# Altium schematic sheet Sheet1.SchDoc
size A3
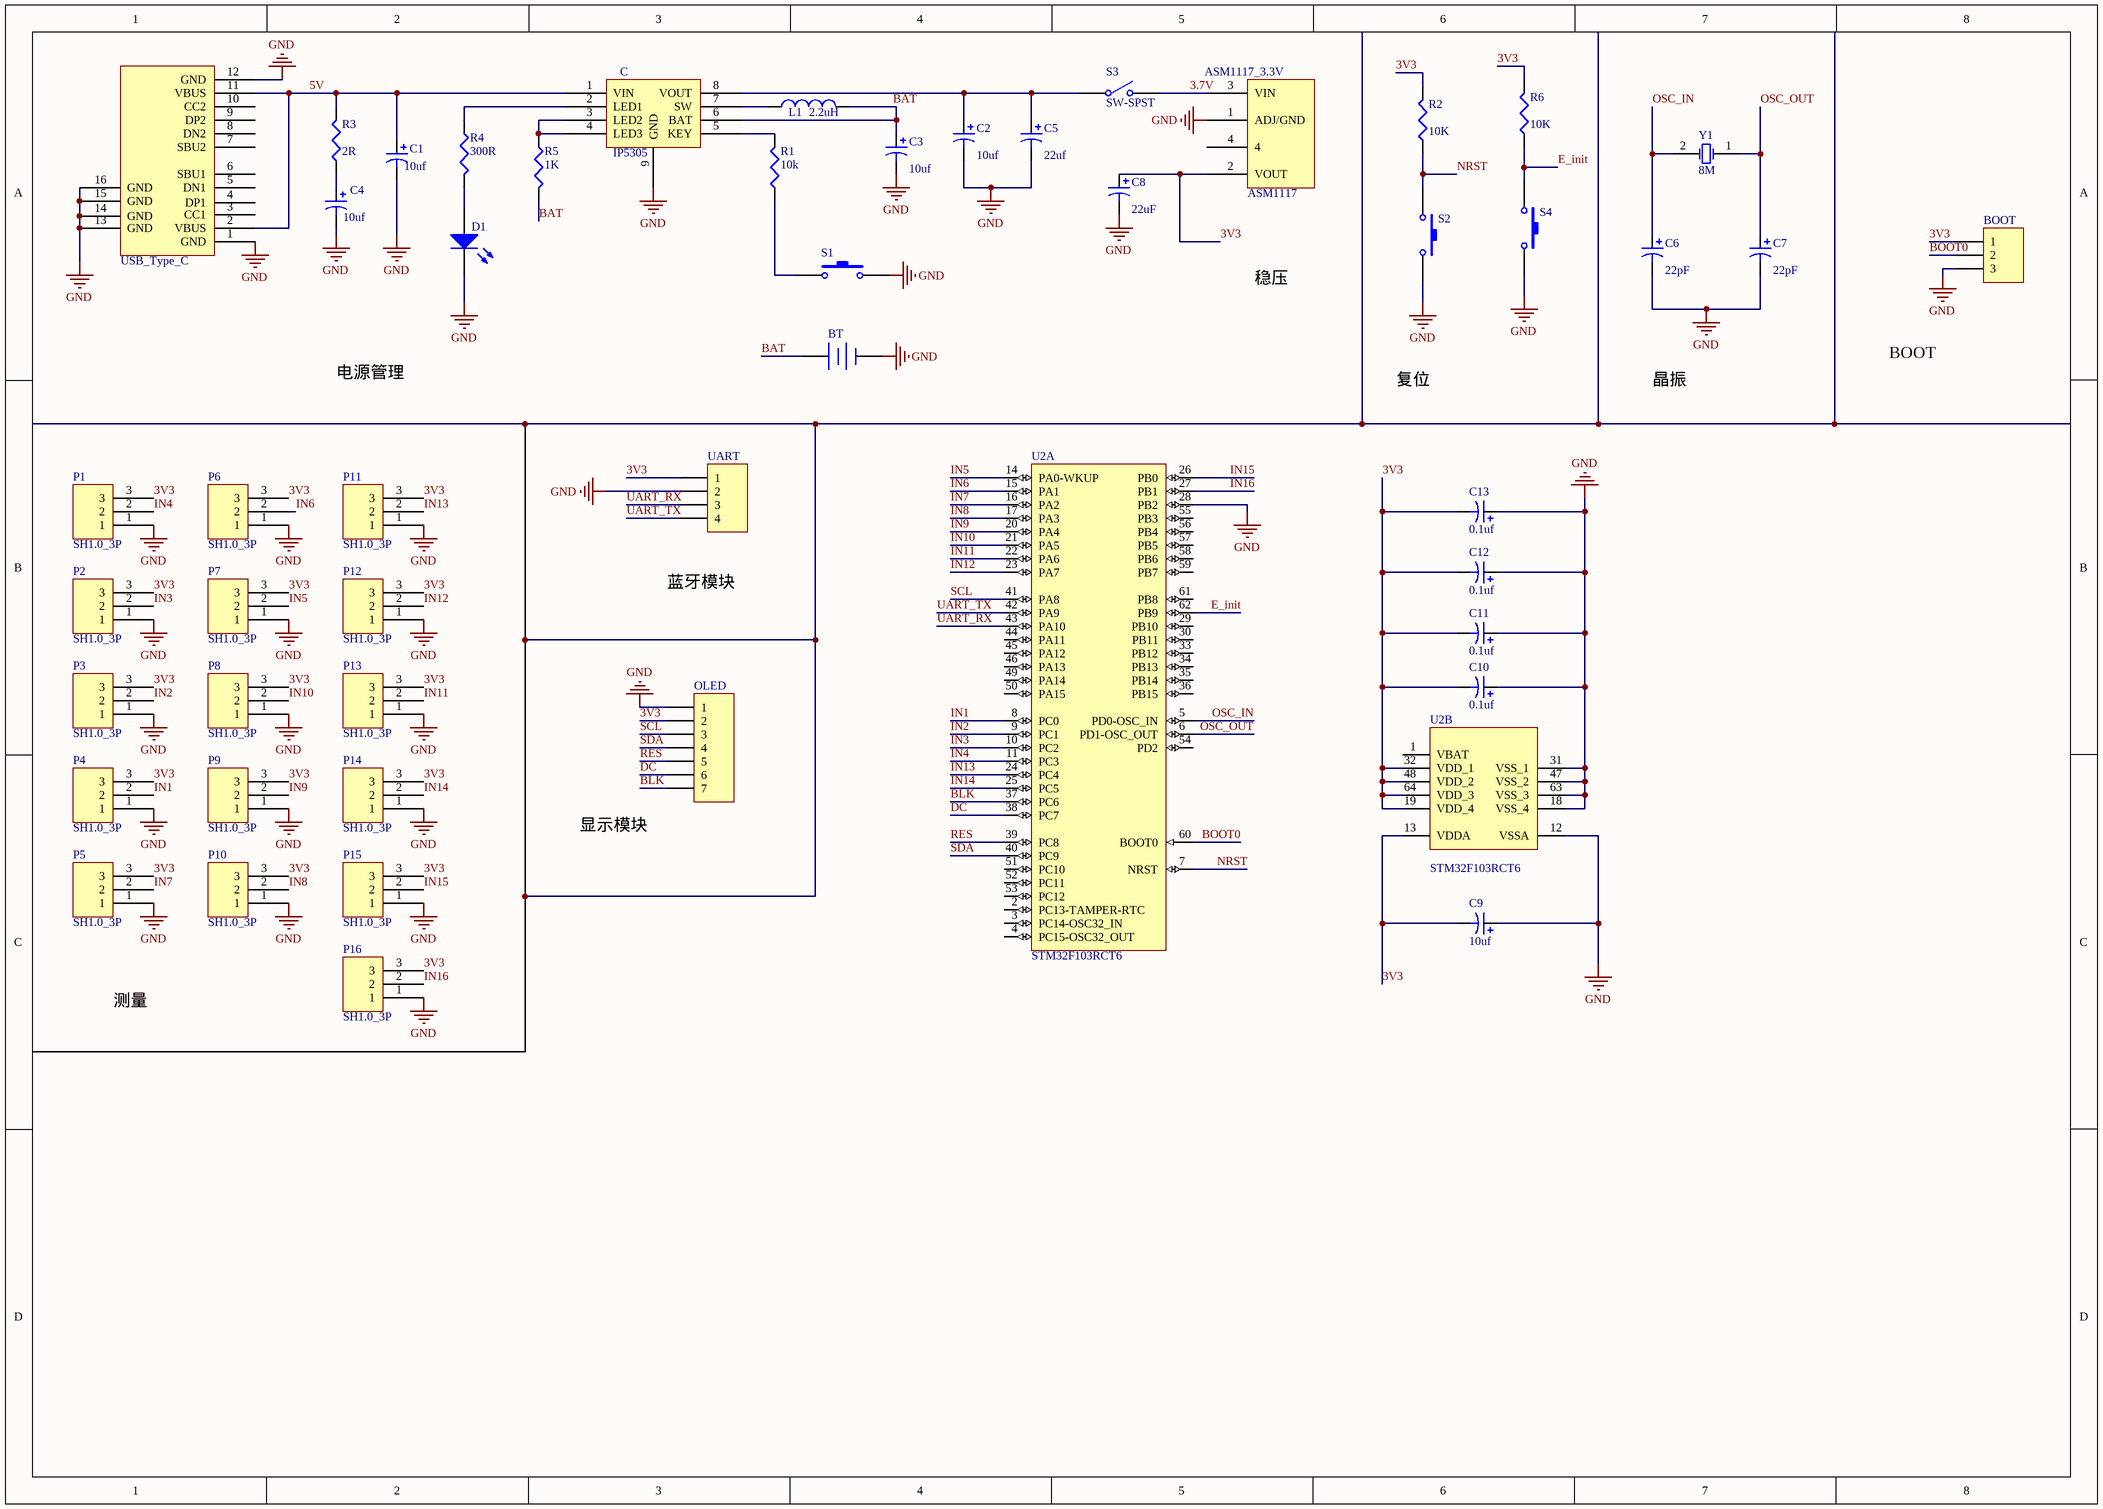
[diagram p0: Sheet1.SchDoc]

## Parts
*  USB_Type_C  [USB_Type_C]
ASM1117  ASM1117_3.3V  [SOT223_N]
BOOT  Header 3  [HDR1X3]  (value not drawn)
BT  Battery  [BAT-2]  (value not drawn)
C  IP5305  [SOP8_1]
C1  value 10uf  [J1-0603]  (hidden comment: Cap Pol3)
C2  value 10uf  [J1-0603]  (hidden comment: Cap Pol3)
C3  value 10uf  [J1-0603]  (hidden comment: Cap Pol3)
C4  value 10uf  [J1-0603]  (hidden comment: Cap Pol3)
C5  value 22uf  [J1-0603]  (hidden comment: Cap Pol3)
C6  value 22pF  [J1-0603]  (hidden comment: Cap Pol3)
C7  value 22pF  [J1-0603]  (hidden comment: Cap Pol3)
C8  value 22uF  [J1-0603]  (hidden comment: Cap Pol3)
C9  value 10uf  [J1-0603]  (hidden comment: Cap Pol3)
C10  value 0.1uf  [J1-0603]  (hidden comment: Cap Pol3)
C11  value 0.1uf  [J1-0603]  (hidden comment: Cap Pol3)
C12  value 0.1uf  [J1-0603]  (hidden comment: Cap Pol3)
C13  value 0.1uf  [J1-0603]  (hidden comment: Cap Pol3)
D1  LED2  [J1-0603]  (value not drawn)
L1  value 2.2uH  [CD43]  (hidden comment: Inductor)
OLED  MHDR1X7  [HDR1X7]  (value not drawn)
P1  SH1.0_3P  [SH1_3P_2]
P2  SH1.0_3P  [SH1_3P_2]
P3  SH1.0_3P  [SH1_3P_2]
P4  SH1.0_3P  [SH1_3P_2]
P5  SH1.0_3P  [SH1_3P_2]
P6  SH1.0_3P  [SH1_3P_2]
P7  SH1.0_3P  [SH1_3P_2]
P8  SH1.0_3P  [SH1_3P_2]
P9  SH1.0_3P  [SH1_3P_2]
P10  SH1.0_3P  [SH1_3P_2]
P11  SH1.0_3P  [SH1_3P_2]
P12  SH1.0_3P  [SH1_3P_2]
P13  SH1.0_3P  [SH1_3P_2]
P14  SH1.0_3P  [SH1_3P_2]
P15  SH1.0_3P  [SH1_3P_2]
P16  SH1.0_3P  [SH1_3P_2]
R1  value 10k  [J1-0603]  (hidden comment: Res3)
R2  value 10K  [J1-0603]  (hidden comment: Res3)
R3  value 2R  [J1-0603]  (hidden comment: Res3)
R4  value 300R  [J1-0603]  (hidden comment: Res3)
R5  value 1K  [J1-0603]  (hidden comment: Res3)
R6  value 10K  [J1-0603]  (hidden comment: Res3)
S1  SW-PB  [SW_DP_1]  (value not drawn)
S2  SW-PB  [SW_DP_1]  (value not drawn)
S3  SW-SPST  [SW_s1]
S4  SW-PB  [SW_DP_1]  (value not drawn)
U2  STM32F103RCT6  [STM-LQFP64_N]  (parts A,B of 2)
UART  Header 4  [HDR1X4]  (value not drawn)
Y1  8M  [YXC_8M]

## Nets
GND: *.1(GND) *.12(GND) *.13(GND) *.14(GND) *.15(GND) *.16(GND) ASM1117.1(ADJ/GND) BOOT.3 BT.2(-) C.9(GND) C1.2 C2.2 C3.2 C4.2 C5.2 C6.2 C7.2 C8.2 C9.1 C10.1 C11.1 C12.1 C13.1 D1.2(K) OLED.1 P1.1 P2.1 P3.1 P4.1 P5.1 P6.1 P7.1 P8.1 P9.1 P10.1 P11.1 P12.1 P13.1 P14.1 P15.1 P16.1 S1.2 S2.2 S4.2 U2.12(VSSA) U2.18(VSS_4) U2.28(PB2) U2.31(VSS_1) U2.47(VSS_2) U2.63(VSS_3) UART.2
3.7V: ASM1117.3(VIN) S3.2(NO)
3V3: ASM1117.2(VOUT) BOOT.1 C8.1 C9.2 C10.2 C11.2 C12.2 C13.2 OLED.2 P1.3 P2.3 P3.3 P4.3 P5.3 P6.3 P7.3 P8.3 P9.3 P10.3 P11.3 P12.3 P13.3 P14.3 P15.3 P16.3 R2.2 R6.2 U2.13(VDDA) U2.19(VDD_4) U2.32(VDD_1) U2.48(VDD_2) U2.64(VDD_3) UART.1
5V: *.2(VBUS) *.11(VBUS) C.1(VIN) C1.1 R3.2
BAT: BT.1(+) C.6(BAT) C3.1 L1.2 R5.2
BLK: OLED.7 U2.37(PC6)
BOOT0: BOOT.2 U2.60(BOOT0)
DC: OLED.6 U2.38(PC7)
E_init: R6.1 S4.1 U2.62(PB9)
IN1: P4.2 U2.8(PC0)
IN2: P3.2 U2.9(PC1)
IN3: P2.2 U2.10(PC2)
IN4: P1.2 U2.11(PC3)
IN5: P7.2 U2.14(PA0-WKUP)
IN6: P6.2 U2.15(PA1)
IN7: P5.2 U2.16(PA2)
IN8: P10.2 U2.17(PA3)
IN9: P9.2 U2.20(PA4)
IN10: P8.2 U2.21(PA5)
IN11: P13.2 U2.22(PA6)
IN12: P12.2 U2.23(PA7)
IN13: P11.2 U2.24(PC4)
IN14: P14.2 U2.25(PC5)
IN15: P15.2 U2.26(PB0)
IN16: P16.2 U2.27(PB1)
NRST: R2.1 S2.1 U2.7(NRST)
OSC_IN: C6.1 U2.5(PD0-OSC_IN) Y1.2(OSC2)
OSC_OUT: C7.1 U2.6(PD1-OSC_OUT) Y1.1(OSC1)
RES: OLED.5 U2.39(PC8)
SCL: OLED.3 U2.41(PA8)
SDA: OLED.4 U2.40(PC9)
UART_RX: U2.43(PA10) UART.3
UART_TX: U2.42(PA9) UART.4
NetC4_1: C4.1 R3.1
NetC_2: C.2(LED1) R4.1
NetC_3: C.3(LED2) C.4(LED3) R5.1
NetC_5: C.5(KEY) R1.2
NetC_7: C.7(SW) L1.1
NetC_8: C.8(VOUT) C2.1 C5.1 S3.1(COMMON)
NetD1_1: D1.1(A) R4.2
NetR1_1: R1.1 S1.1

Not connected (* = marked no-connect by the designer): * 3(CC1) 4(DP1) 5(DN1) 6(SBU1) 7(SBU2) 8(DN2) 9(DP2) 10(CC2); ASM1117 4; U2 1(VBAT) 2(PC13-TAMPER-RTC) 3(PC14-OSC32_IN) 4(PC15-OSC32_OUT) 29(PB10) 30(PB11) 33(PB12) 34(PB13) 35(PB14) 36(PB15) 44(PA11) 45(PA12) 46(PA13) 49(PA14) 50(PA15) 51(PC10) 52(PC11) 53(PC12) 54(PD2) 55(PB3) 56(PB4) 57(PB5) 58(PB6) 59(PB7) 61(PB8)

## Notes on the sheet
- 稳压
- 电源管理
- BOOT
- 复位
- 晶振
- 蓝牙模块
- 显示模块
- 测量
- Title
- Size:
- Date:
- A4
- Number:
- Time:
- Revision:
- Sheet
- of
- File:

## Library data of the parts
BOOT = Header 3: Header, 3-Pin; LatestRevisionDate: 17-Jul-2002; LatestRevisionNote: Re-released for DXP Platform.; Publisher: Altium Limited
BT = Battery: Multicell Battery; Published: 24-Mar-1999; LatestRevisionDate: 17-Jul-2002; LatestRevisionNote: Re-released for DXP Platform.; PackageReference: BAT-2; Publisher: Altium Limited; PackageDescription: Battery; 2 Leads
C1-C13 = Cap Pol3: Polarized Capacitor (Surface Mount); Published: 8-Jun-2000; LatestRevisionDate: 29-May-2009; LatestRevisionNote: IPC-7351 Footprint Added.; PackageReference: C0805; Publisher: Altium Limited; PackageDescription: Chip Capacitor
D1 = LED2: Typical RED, GREEN, YELLOW, AMBER GaAs LED; Published: 8-Jun-2000; LatestRevisionDate: 17-Jul-2002; LatestRevisionNote: Re-released for DXP Platform.; PackageVersion: Feb-2002; PackageReference: 3.2X1.6X1.1; Publisher: Altium Limited; PackageDescription: SM LED; 2 Flat Leads
L1 = Inductor: Code_IEC: 1005; Published: 8-Jun-2000; LatestRevisionDate: 29-May-2009; LatestRevisionNote: IPC-7351 Footprint Added.; PackageReference: 0402-A; Publisher: Altium Limited; PackageDescription: Chip Inductor; Code_JEITA: 0402
OLED = MHDR1X7: Header, 7-Pin; LatestRevisionDate: 17-Jul-2002; LatestRevisionNote: Re-released for DXP Platform.; Publisher: Altium Limited
R1-R6 = Res3: Resistor; Published: 8-Jun-2000; LatestRevisionDate: 29-May-2009; LatestRevisionNote: IPC-7351 Footprint Added.; PackageReference: J1-0603; Publisher: Altium Limited; PackageDescription: Chip Resistor
S1 S2 S4 = SW-PB: Switch; Published: 24-Mar-1999; LatestRevisionDate: 17-Jul-2002; LatestRevisionNote: Re-released for DXP Platform.; PackageReference: SPST-2; Publisher: Altium Limited; PackageDescription: Switch; 2 Leads
S3 = SW-SPST: Single-Pole, Single-Throw Switch; Published: 24-Mar-1999; LatestRevisionDate: 17-Jul-2002; LatestRevisionNote: Re-released for DXP Platform.; PackageReference: SPST-2; Publisher: Altium Limited; PackageDescription: Switch; 2 Leads
U2 = STM32F103RCT6: ARM Cortex-M3 32-bit MCU, 256 KB Flash, 48 KB Internal RAM, 51 I/Os, 64-pin LQFP, -40 to 85 degC, Tray; A/D Converter: 3x12-bit (16 Channel); D/A Converter: 2x12-bit (2 Channel); FLASH Size (Prog) (kB): 256; I/Os (High Current): 51; Internal RAM Size (kB): 48; Operating Frequency(F) (Processor speed) (MHz): 72; Supply Voltage(Vcc) min (V): 2; DatasheetVersion: Rev. 8; PackageVersion: Rev. 4, 06/2013; PackageReference: LQFP64; PackageDescription: 64-Pin Low Profile Quad Flat Package, 10 x 10 mm Body, 0.5 mm Pitch; Supplier 1: Digi-Key; Supplier Part Number 1: 497-9033-ND; Supplier 2: Newark; Supplier Part Number 2: 01P4099; Supplier 3: Newark; Supplier Part Number 3: 57P1227; Supplier 4: Mouser; Supplier Part Number 4: 511-STM32F103RCT6; Core: ARM Cortex-M3; Packing: Tray; Mounting Technology: Surface Mount; PartNumber: STM32F103RCT6; ComponentLink1Description: Manufacturer URL; ComponentLink1URL: http://www.st.com/web/en/home.html; ComponentLink2Description: Datasheet; ComponentLink2URL: http://www.st.com/st-web-ui/static/active/en/resource/technical/document/datasheet/CD00191185.pdf; ComponentLink3Description: Package Specification; ComponentLink3URL: http://www.st.com/st-web-ui/static/active/en/resource/technical/document/datasheet/DM00037051.pdf
UART = Header 4: Header, 4-Pin; LatestRevisionDate: 17-Jul-2002; LatestRevisionNote: Re-released for DXP Platform.; Publisher: Altium Limited
Y1 = XTAL: Crystal Oscillator; Published: 8-Jun-2000; LatestRevisionDate: 17-Jul-2002; LatestRevisionNote: Re-released for DXP Platform.; PackageReference: R38; Publisher: Altium Limited; PackageDescription: Crystal, Thru-Hole; 2 Leads; Body 3.1 x 8.2 mm (Dia.xH)